# EAGLE design scheme (EAGLE 6.3)
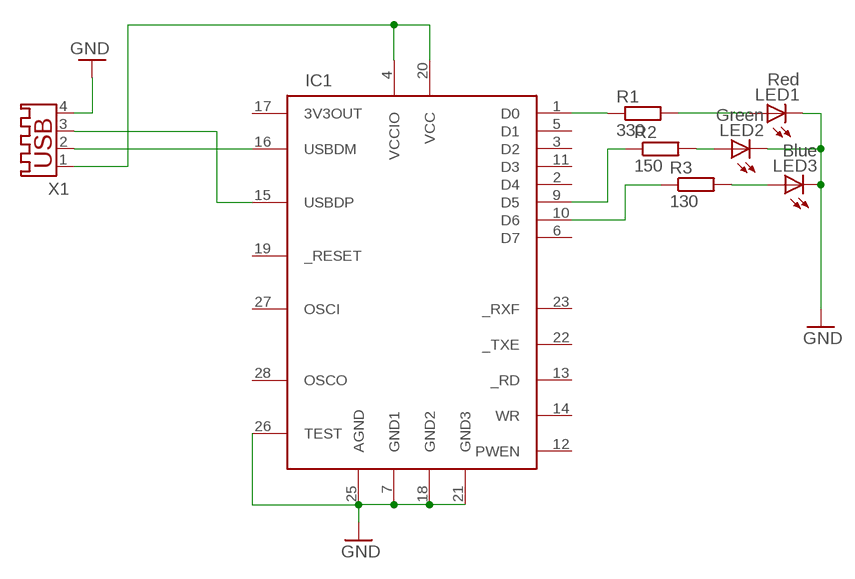
[diagram p0: schematic, sheet 1]

## Parts
IC1  FT245RL  [SSOP28DB]
LED1  Red  NFSG036BT  [NFSG036BT]
LED2  Green  NFSG036BT  [NFSG036BT]
LED3  Blue  NFSG036BT  [NFSG036BT]
R1  330  R-EU_M1406  [M1406]
R2  150  R-EU_M1406  [M1406]
R3  130  R-EU_M1406  [M1406]
X1  USB-A003BOTTOM  [USB-A003-BOTTOM]

## Nets
GND: IC1.7(GND1) IC1.18(GND2) IC1.21(GND3) IC1.25(AGND) IC1.26(TEST) LED1.C LED2.C LED3.C X1.4(GND-4)
N$1: IC1.4(VCCIO) IC1.20(VCC) X1.1(V+1)
N$2: IC1.16(USBDM) X1.2(D-2)
N$3: IC1.15(USBDP) X1.3(D+3)
N$4: IC1.1(D0) R1.1
N$5: IC1.10(D6) R3.1
N$6: IC1.9(D5) R2.1
N$7: LED2.A R2.2
N$8: LED1.A R1.2
N$9: LED3.A R3.2
Unconnected: IC1.2(D4) IC1.3(D2) IC1.5(D1) IC1.6(D7) IC1.11(D3) IC1.12(PWEN) IC1.13(_RD) IC1.14(WR) IC1.17(3V3OUT) IC1.19(_RESET) IC1.22(_TXE) IC1.23(_RXF) IC1.27(OSCI) IC1.28(OSCO)

## Library data of the parts
IC1 = ftdichip-3:FT245RL: USB FIFO Controller 4th Generation USB Controller (USB <-> Parallel) - FIFO
LED1-LED3 = led:NFSG036BT: CHIP TYPE GREEN LED NFSx036xT Source: NICHIA CORPORATION .. NFSG036BT-E.pdf
R1-R3 = resistor:R-EU_: RESISTOR, European symbol
X1 = shmuma:USB-A003: USB connector

## Board
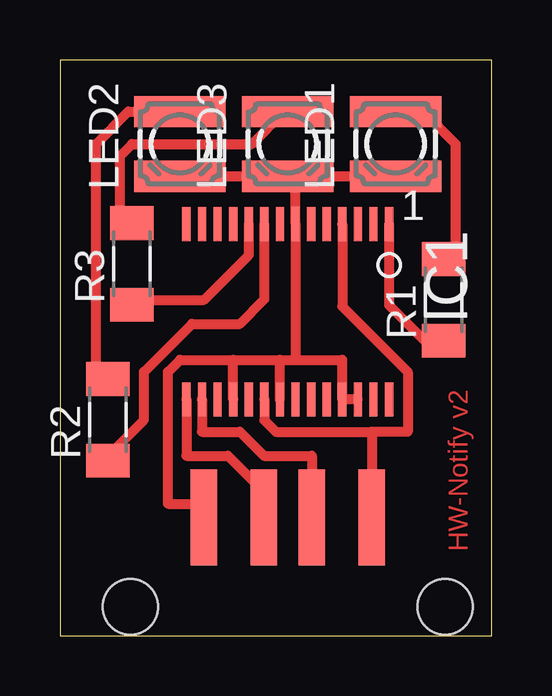
[diagram p1: board, top side]
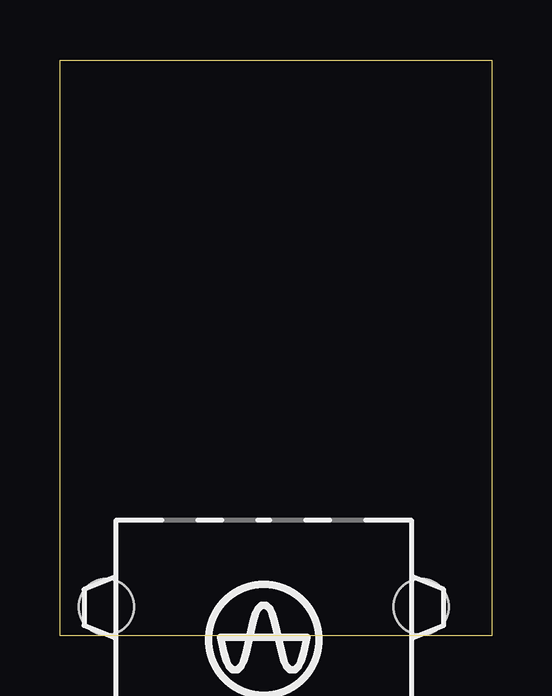
[diagram p2: board, bottom side, seen from below]

Size 18 x 24 mm. Coordinates in mm from the lower left corner, seen from the top.
Outline: 0,0 18,0 18,24 0,24 0,0
Copper layers (1*16): Top 0.035mm / dielectric 1.5mm / Bottom 0.035mm
Design rules "default": minimum track width 10mil, minimum drill 24mil, track to track 8mil, track to pad 8mil, pad to pad 8mil, via to via 8mil, smd to smd 8mil, copper to edge 40mil, drill to drill 8mil, minimum pad ring 10mil, minimum via ring 8mil, stop-mask expansion 4mil, vias tented up to drill 0mil, thermal gap 10mil

### Footprints (pad centres in the part's own frame; a part is rotated, then mirrored left to right if it is on the bottom)
SSOP28DB = smd 0.348 x 1.397: 1 -4.225,-3.656; 2 -3.575,-3.656; 3 -2.925,-3.656; 4 -2.275,-3.656; 5 -1.625,-3.656; 6 -0.975,-3.656; 7 -0.325,-3.656; 8 0.325,-3.656; 9 0.975,-3.656; 10 1.625,-3.656; 11 2.275,-3.656; 12 2.925,-3.656; 13 3.575,-3.656; 14 4.225,-3.656; 15 4.225,3.656; 16 3.575,3.656; 17 2.925,3.656; 18 2.275,3.656; 19 1.625,3.656; 20 0.975,3.656; 21 0.325,3.656; 22 -0.325,3.656; 23 -0.975,3.656; 24 -1.625,3.656; 25 -2.275,3.656; 26 -2.925,3.656; 27 -3.575,3.656; 28 -4.225,3.656
NFSG036BT = smd 1.3 x 3.8: A 1.35,0; C -1.35,0
M1406 = smd 1.4 x 1.8: 1 -1.7,0; 2 1.7,0
USB-A003-BOTTOM = smd 1.12 x 4 bottom: 1 -3.5,8.92; 2 -1,8.92; 3 1,8.92; 4 3.5,8.92 | hole 2.3: -6.57,5.2; 6.57,5.2

### Placement (x,y rotation side)
IC1  9.5,13.5 180 top
LED1  14,20.5 90 top
LED2  5,20.5 90 top
LED3  9.5,20.5 90 top
R1  16,14 90 top
R2  2,9 90 top
R3  3,15.5 90 top
X1  9.5,-4 0 bottom

### Tracks (layer width: path | path; a pad name or v marks a point on that pad's centre or on a via)
GND
  Top 0.406: 6,5 X1.4 6,5.5 4.5,5.5 4.5,11 5,11.5 7.22,11.5 | 7.22,11.5 9.18,11.5 | 9.18,11.5 9.82,11.5 | 9.82,11.5 11.78,11.5 IC1.25 IC1.26 | IC1.18 7.22,11.5 | IC1.21 9.18,11.5 | 9.82,11.5 IC1.7 9.82,19.15 LED3.C | LED2.C LED3.C | LED3.C LED1.C
N$1
  Top 0.406: IC1.20 8.53,8.97 9,8.5 13,8.5 | 13,8.5 X1.1 | IC1.4 11.78,13.72 14.5,11 14.5,8.5 13,8.5
N$2
  Top 0.406: IC1.16 5.92,8.5 7.5,8.5 8.5,7.5 10.5,7.5 X1.2
N$3
  Top 0.406: IC1.15 5.28,7.5 7,7.5 8.5,6 X1.3
N$4
  Top 0.406: IC1.1 13.72,13.78 15.2,12.3 R1.1
N$5
  Top 0.406: R3.1 3.2,14 6,14 7.88,15.88 IC1.10
N$6
  Top 0.406: R2.1 2,7.5 3.5,9 3.5,11 5.5,13 7.5,13 8.53,14.03 IC1.9
N$7
  Top 0.406: R2.2 1.5,11.2 1.5,20.5 2.85,21.85 LED2.A
N$8
  Top 0.406: R1.2 16.5,16.2 16.5,20.5 15.5,21.5 14.35,21.5 LED1.A
N$9
  Top 0.406: R3.2 2.5,17.7 2.5,20 3,20.5 8,20.5 9.35,21.85 LED3.A

### Text on the board
Top: HW-Notify v2